# Altium schematic sheet Sheet1.SchDoc
size A4
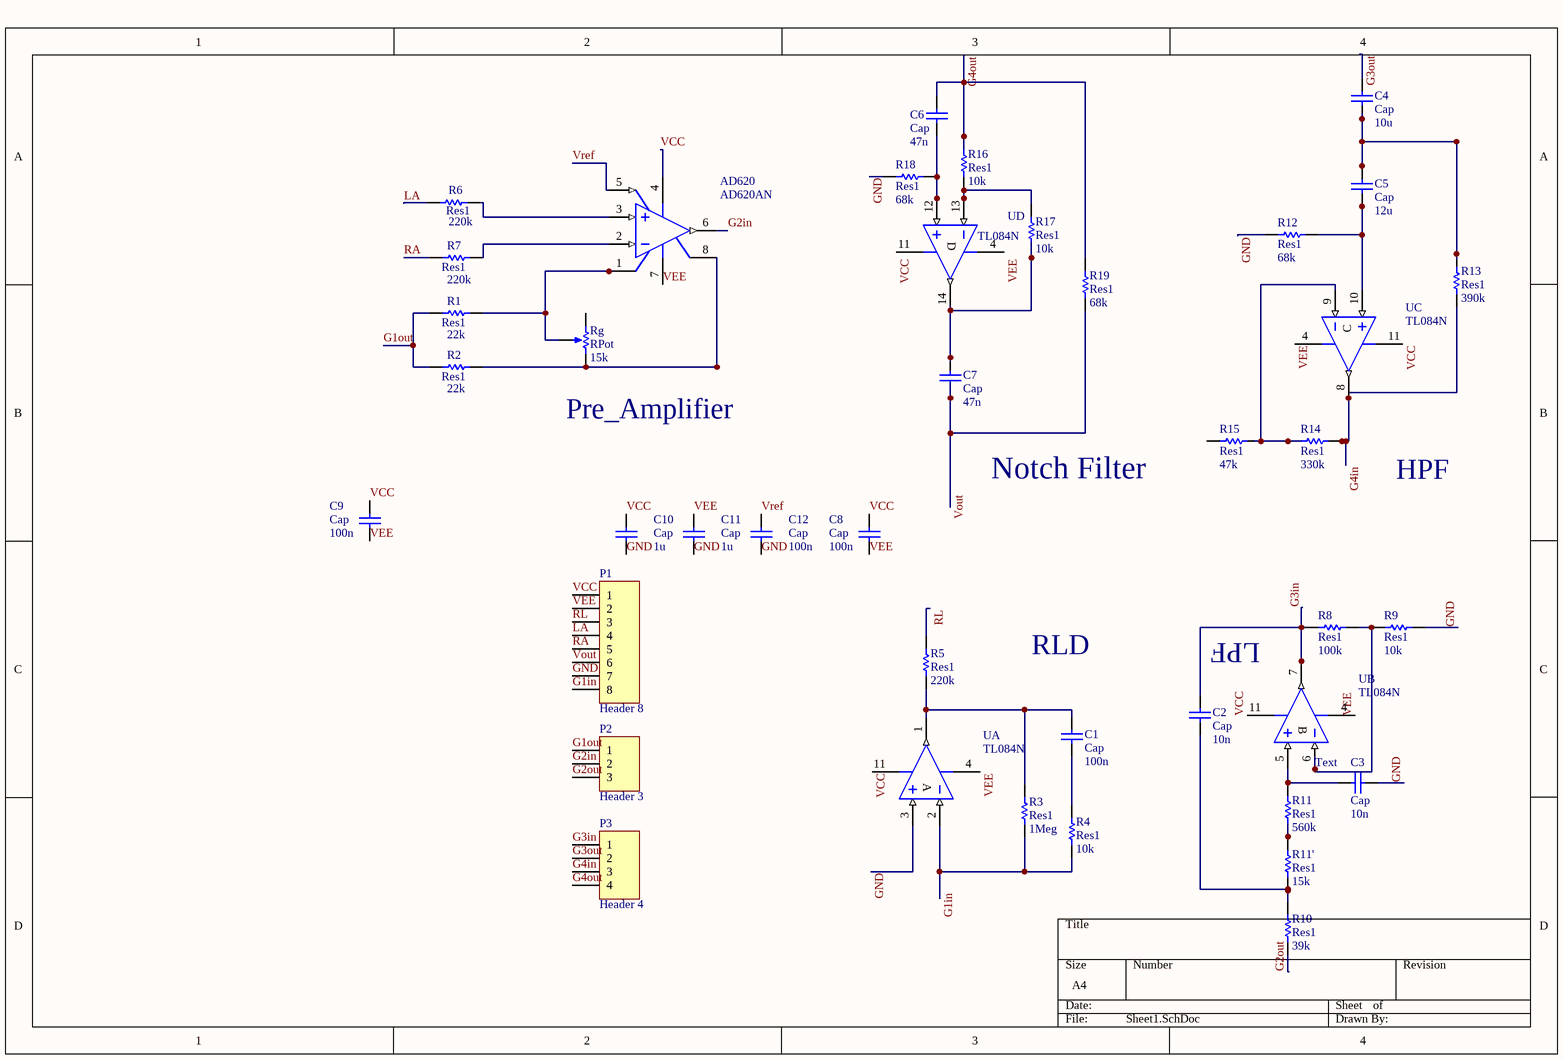
[diagram p0: Sheet1.SchDoc]

## Parts
AD620  AD620AN  [N-8]
C1  Cap  value 100n  [RAD-0.3]
C2  Cap  value 10n  [RAD-0.3]
C3  Cap  value 10n  [RAD-0.3]
C4  Cap  value 10u  [RAD-0.3]
C5  Cap  value 12u  [RAD-0.3]
C6  Cap  value 47n  [RAD-0.3]
C7  Cap  value 47n  [RAD-0.3]
C8  Cap  value 100n  [RAD-0.3]
C9  Cap  value 100n  [RAD-0.3]
C10  Cap  value 1u  [RAD-0.3]
C11  Cap  value 1u  [RAD-0.3]
C12  Cap  value 100n  [RAD-0.3]
P1  Header 8  [HDR1X8]
P2  Header 3  [HDR1X3]
P3  Header 4  [HDR1X4]
R1  Res1  value 22k  [AXIAL-0.3]
R2  Res1  value 22k  [AXIAL-0.3]
R3  Res1  value 1Meg  [AXIAL-0.3]
R4  Res1  value 10k  [AXIAL-0.3]
R5  Res1  value 220k  [AXIAL-0.3]
R6  Res1  value 220k  [AXIAL-0.3]
R7  Res1  value 220k  [AXIAL-0.3]
R8  Res1  value 100k  [AXIAL-0.3]
R9  Res1  value 10k  [AXIAL-0.3]
R10  Res1  value 39k  [AXIAL-0.3]
R11  Res1  value 560k  [AXIAL-0.3]
R11'  Res1  value 15k  [AXIAL-0.3]
R12  Res1  value 68k  [AXIAL-0.3]
R13  Res1  value 390k  [AXIAL-0.3]
R14  Res1  value 330k  [AXIAL-0.3]
R15  Res1  value 47k  [AXIAL-0.3]
R16  Res1  value 10k  [AXIAL-0.3]
R17  Res1  value 10k  [AXIAL-0.3]
R18  Res1  value 68k  [AXIAL-0.3]
R19  Res1  value 68k  [AXIAL-0.3]
Rg  RPot  value 15k  [VR5]
U  TL084N  [N014]  (parts A,B,C,D of 4)

## Nets
G1in: P1.8 R3.2 R4.2 U.2(IN-)
G1out: P2.1 R1.1 R2.1
G2in: AD620.6(OUT) P2.2
G2out: P2.3 R10.1
G3in: C2.2 P3.1 U.7(OUT)
G3out: C4.1 P3.2
G4in: P3.3 R13.2 R14.2 U.8(OUT)
G4out: C6.1 P3.4 R16.1 R19.1
GND: C3.1 C10.2 C11.2 C12.2 P1.7 R9.1 R12.1 R18.1 U.3(IN+)
LA: P1.4 R6.1
RA: P1.5 R7.1
RL: P1.3 R5.1
VCC: AD620.4(V-) C8.1 C9.1 C10.1 P1.1 U.11(V-)
VEE: AD620.7(V+) C8.2 C9.2 C11.1 P1.2 U.4(V+)
Vout: C7.2 P1.6 R19.2
Vref: AD620.5(REF) C12.1
NetAD620_1: AD620.1(RG) R1.2 Rg.3(TAP)
NetAD620_2: AD620.2(-IN) R7.2
NetAD620_3: AD620.3(+IN) R6.2
NetAD620_8: AD620.8(RG) R2.2 Rg.2(BOT)
NetC1_1: C1.1 R3.1 R5.2 U.1(OUT)
NetC1_2: C1.2 R4.1
NetC2_1: C2.1 R10.2 R11'.1
NetC3_2: C3.2 R11.2 U.5(IN+)
NetC4_2: C4.2 C5.1 R13.1
NetC5_2: C5.2 R12.2 U.10(IN+)
NetC6_2: C6.2 R18.2 U.12(IN+)
NetC7_1: C7.1 R17.2 U.14(OUT)
NetR8_1: R8.1 R9.2 U.6(IN-)
NetR11_1: R11.1 R11'.2
NetR14_1: R14.1 R15.2 U.9(IN-)
NetR16_2: R16.2 R17.1 U.13(IN-)

Not connected (* = marked no-connect by the designer): R8 2; R15 1; Rg 1(TOP)

## Notes on the sheet
- (near Rg) Pre_Amplifier
- (near R15) Notch Filter
- HPF
- RLD
- (near U) LPF
- Text
- Labels drawn without touching a wire or pin: VCC, VEE
- (in symbol TL084N, part A) A
- (in symbol TL084N, part B) B
- (in symbol TL084N, part C) C
- (in symbol TL084N, part D) D

## Library data of the parts
AD620 = AD620AN: Low-Cost, Low-Power Instrumentation Amplifier; Published: 8-Jun-2000; LatestRevisionDate: 04-Mar-2005; LatestRevisionNote: Stylized 3D Model Added.; DatasheetVersion: REV.D 1998; PackageVersion: revA; PackageReference: N-8; Publisher: Altium Limited; PackageDescription: DIP; 8 Leads; Row Spacing 7.62 mm; Pitch 2.54 mm; ComponentLink1Description: Manufacturer Link; ComponentLink1URL: http://www.analog.com/en/prod/0%2C2877%2CAD620%2C00.html; ComponentLink2Description: Datasheet; ComponentLink2URL: http://www.analog.com/UploadedFiles/Data_Sheets/897653854AD620_g.pdf
C1-C12 = Cap: Capacitor; Published: 8-Jun-2000; LatestRevisionDate: 17-Jul-2002; LatestRevisionNote: Re-released for DXP Platform.; PackageReference: RAD-0.3; Publisher: Altium Limited; PackageDescription: Radial Cap, Thru-Hole; 2 Leads; 0.3 in Pin Spacing
P1 = Header 8: Header, 8-Pin; LatestRevisionDate: 17-Jul-2002; LatestRevisionNote: Re-released for DXP Platform.; Publisher: Altium Limited
P2 = Header 3: Header, 3-Pin; LatestRevisionDate: 17-Jul-2002; LatestRevisionNote: Re-released for DXP Platform.; Publisher: Altium Limited
P3 = Header 4: Header, 4-Pin; LatestRevisionDate: 17-Jul-2002; LatestRevisionNote: Re-released for DXP Platform.; Publisher: Altium Limited
R1-R11 R11' R12-R19 = Res1: Resistor; Published: 8-Jun-2000; LatestRevisionDate: 17-Jul-2002; LatestRevisionNote: Re-released for DXP Platform.; PackageReference: AXIAL-0.3; Publisher: Altium Limited; PackageDescription: Axial Device, Thru-Hole; 2 Leads; 0.3 in Pin Spacing
Rg = RPot: Potentiometer; Sim Note: Enter the Resistance value and the set point into parameter fields.; Set Position: 0.5; Published: 8-Jun-2000; LatestRevisionDate: 17-Jul-2002; LatestRevisionNote: Re-released for DXP Platform.; PackageReference: VR5; Publisher: Altium Limited; PackageDescription: Variable Resistor, Thru-Hole; 3 Leads
U = TL084N: JFET-Input Operational Amplifier; Published: 16-Jan-2001; LatestRevisionDate: 04-Mar-2005; LatestRevisionNote: Stylized 3D Model Added.; DatasheetVersion: Feb-1999; PackageVersion: Oct-1995; PackageReference: N014; Publisher: Altium Limited; PackageDescription: DIP; 14 Leads; Row Spacing 7.62 mm; Pitch 2.54 mm; ComponentLink1Description: Manufacturer Link; ComponentLink1URL: http://www.ti.com/; ComponentLink2Description: Datasheet; ComponentLink2URL: http://www-s.ti.com/sc/ds/tl084.pdf